# Altium project ESE516_IoTracking.PrjPcb
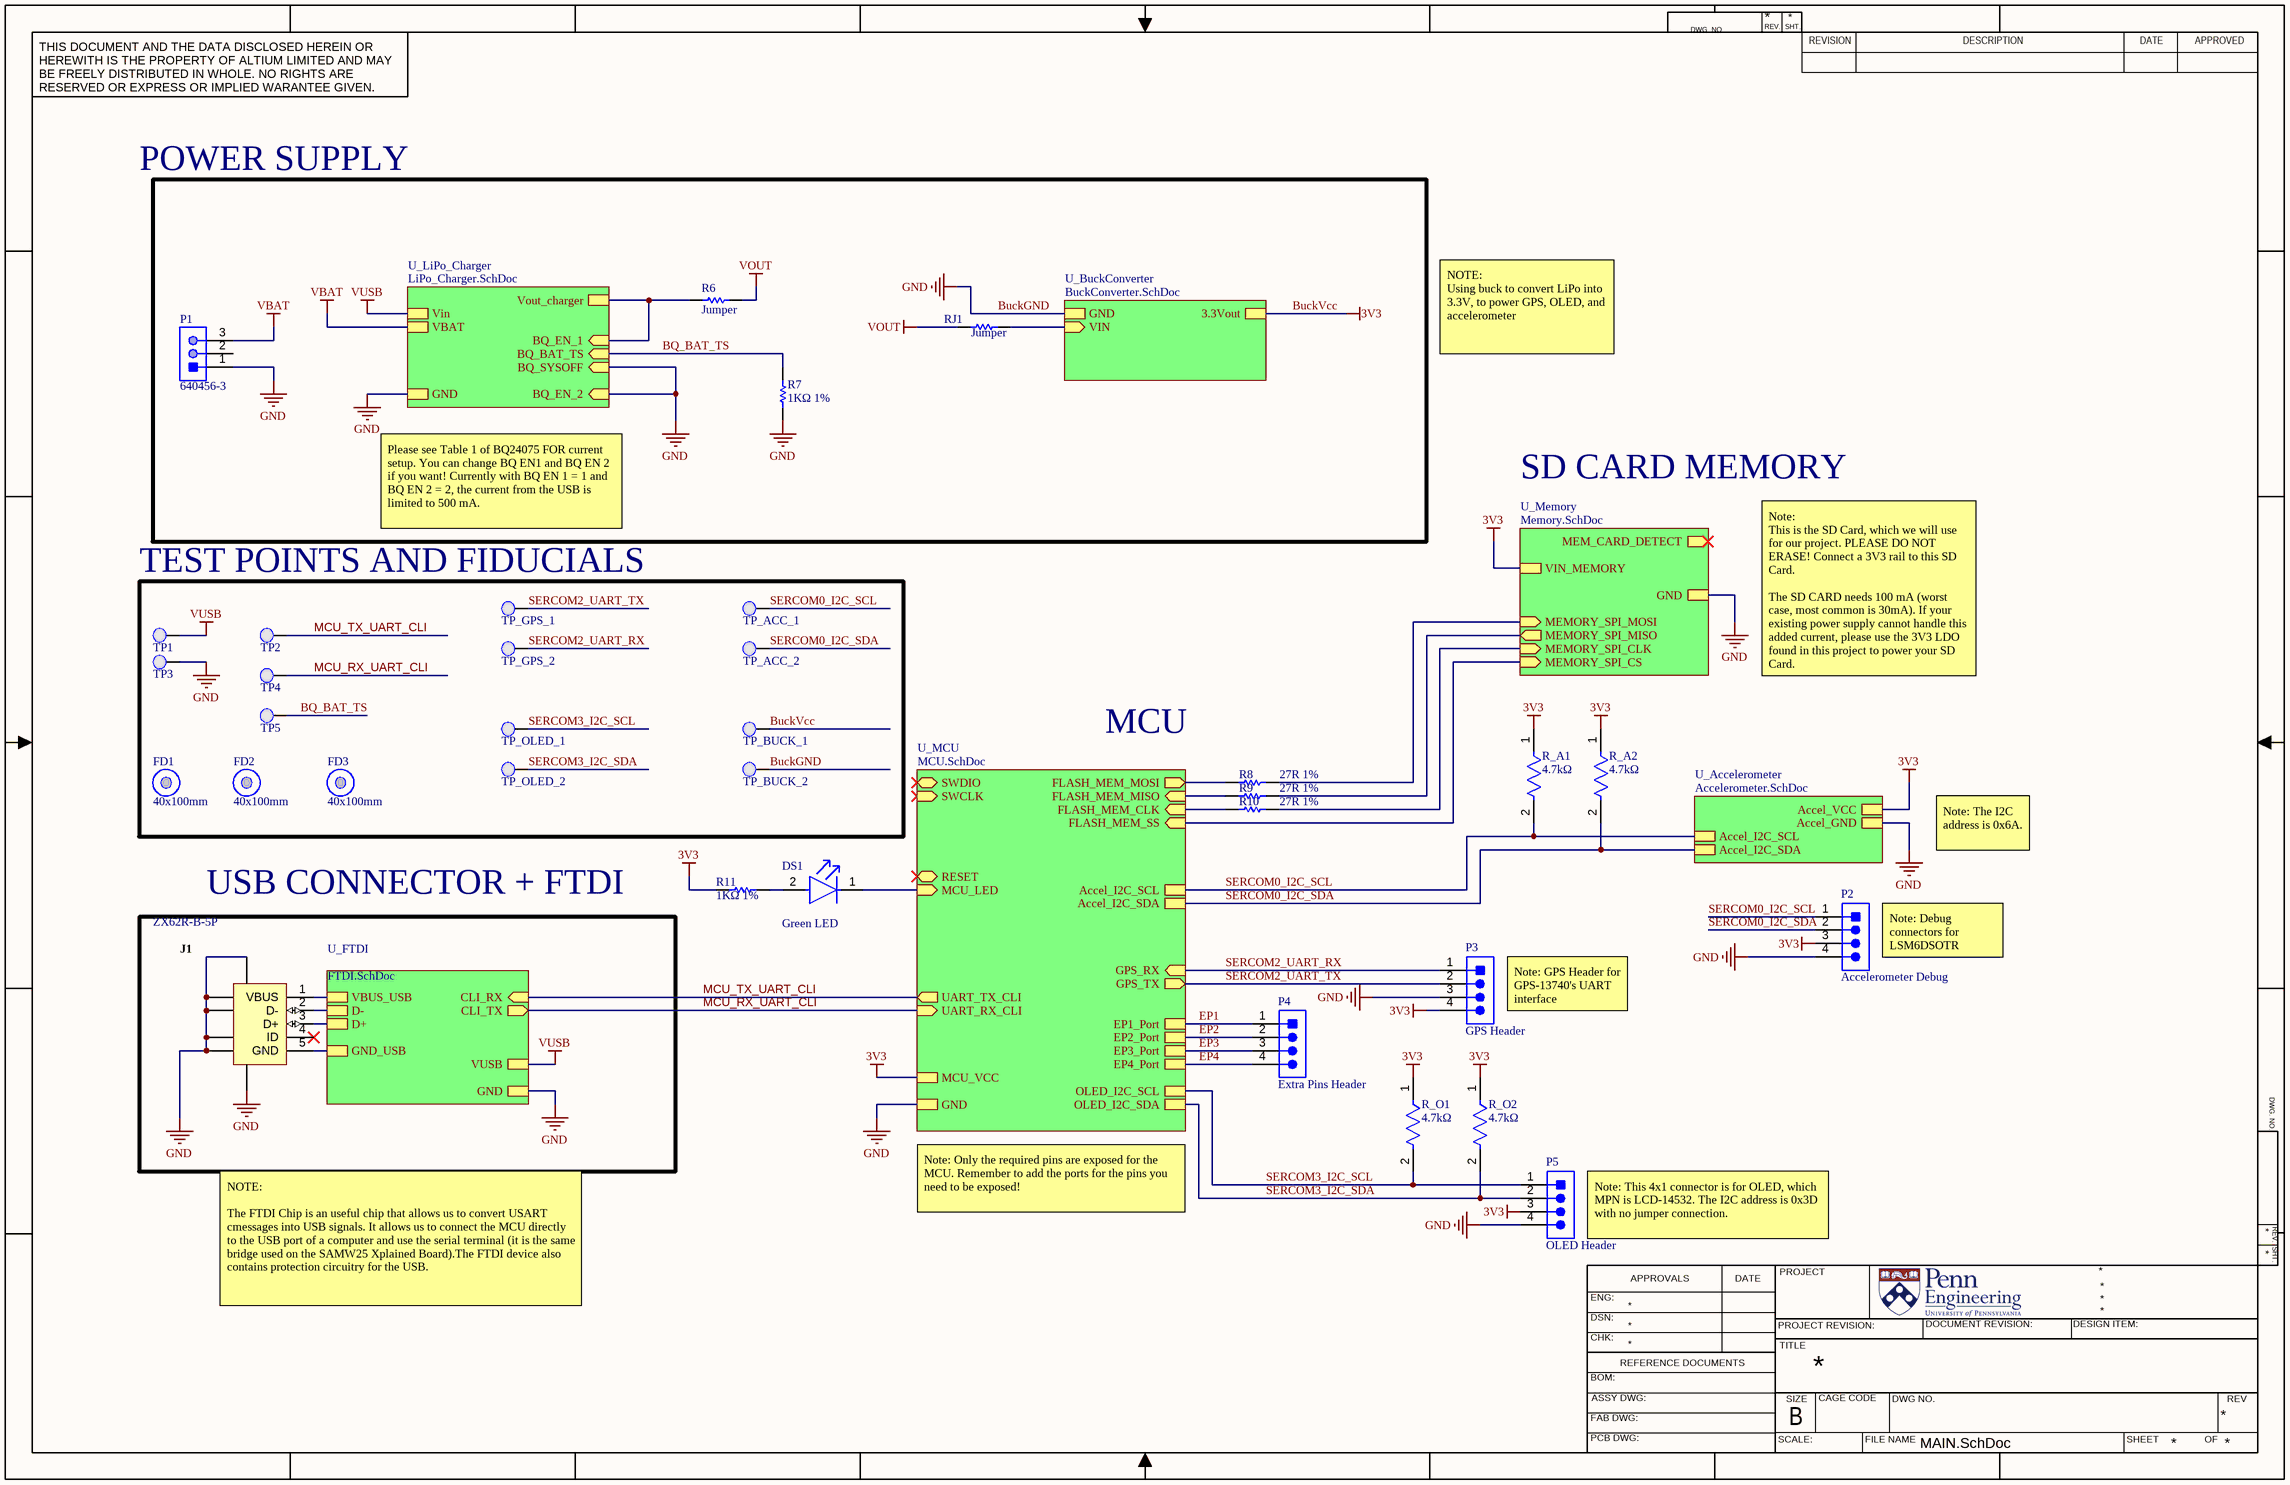
[diagram p0: MAIN.SchDoc]
7 sheets, 94 parts. Net scope: strictly hierarchical (ports join the sheet entries above them; power ports are local).
Board file: IoTracking_PCB.PcbDoc
Sheets:
  MAIN.SchDoc
    U_FTDI = FTDI.SchDoc
    U_Memory = Memory.SchDoc
    U_LiPo_Charger = LiPo_Charger.SchDoc
    U_BuckConverter = BuckConverter.SchDoc
    U_Accelerometer = Accelerometer.SchDoc
    U_MCU = MCU.SchDoc

## Sheet MAIN.SchDoc
size 431 x 279 mm

### Parts
DS1  Green LED  [FP-LTST-C191KGKT-MFG]
FD1  40x100mm  [Fiducial_FT]
FD2  40x100mm  [Fiducial_FT]
FD3  40x100mm  [Fiducial_FT]
J1  ZX62R-B-5P  [HIRO-ZX62R-B-5P_V]
P1  640456-3  [TECO-640456-3]
P2  Accelerometer Debug  [TECO-640456-4]
P3  GPS Header  [TECO-640456-4]
P4  Extra Pins Header  [TECO-640456-4]
P5  OLED Header  [TECO-640456-4]
R6  Jumper  [RESC0805(2012)_N]
R7  1KΩ 1%  [RESC1609X50X30LL10T20]
R8  27R 1%  [RESC0603(1608)_N]
R9  27R 1%  [RESC0603(1608)_N]
R10  27R 1%  [RESC0603(1608)_N]
R11  1KΩ 1%  [RESC1609X50X30LL10T20]
R_A1  4.7kΩ  [FP-AT0603-MFG]
R_A2  4.7kΩ  [FP-AT0603-MFG]
R_O1  4.7kΩ  [FP-AT0603-MFG]
R_O2  4.7kΩ  [FP-AT0603-MFG]
RJ1  Jumper  [RESC1609X50X30LL10T20]
TP1  0.1" Pad  [PCBComponent]  (value not drawn)
TP2  0.1" Pad  [PCBComponent]  (value not drawn)
TP3  0.1" Pad  [PCBComponent]  (value not drawn)
TP4  0.1" Pad  [PCBComponent]  (value not drawn)
TP5  0.1" Pad  [PCBComponent]  (value not drawn)
TP_ACC_1  0.1" Pad  [PCBComponent]  (value not drawn)
TP_ACC_2  0.1" Pad  [PCBComponent]  (value not drawn)
TP_BUCK_1  0.1" Pad  [PCBComponent]  (value not drawn)
TP_BUCK_2  0.1" Pad  [PCBComponent]  (value not drawn)
TP_GPS_1  0.1" Pad  [PCBComponent]  (value not drawn)
TP_GPS_2  0.1" Pad  [PCBComponent]  (value not drawn)
TP_OLED_1  0.1" Pad  [PCBComponent]  (value not drawn)
TP_OLED_2  0.1" Pad  [PCBComponent]  (value not drawn)

### Blocks framed on the sheet
TEST POINTS AND FIDUCIALS: FD1-FD3 TP1-TP5 TP_ACC_1 TP_ACC_2 TP_BUCK_1 TP_BUCK_2 TP_GPS_1 TP_GPS_2 TP_OLED_1 TP_OLED_2
USB CONNECTOR + FTDI: J1

### Sub-sheets
U_Accelerometer = Accelerometer.SchDoc: Accel_VCC, Accel_GND, Accel_I2C_SCL, Accel_I2C_SDA
U_BuckConverter = BuckConverter.SchDoc: VIN (in), GND, 3.3Vout
U_FTDI = FTDI.SchDoc: CLI_RX (in), CLI_TX (out), VUSB, GND, VBUS_USB, D-, D+, GND_USB
U_LiPo_Charger = LiPo_Charger.SchDoc: BQ_EN_2 (in), BQ_SYSOFF (in), BQ_EN_1 (in), BQ_BAT_TS (in), Vin, GND, VBAT, Vout_charger
U_MCU = MCU.SchDoc: SWDIO (bidir), SWCLK (in), UART_TX_CLI (out), UART_RX_CLI (in), FLASH_MEM_SS (in), FLASH_MEM_CLK (in), FLASH_MEM_MISO (in), FLASH_MEM_MOSI (out), RESET (bidir), MCU_LED (in), MCU_VCC, GND, GPS_RX (in), GPS_TX (out), OLED_I2C_SCL, OLED_I2C_SDA, Accel_I2C_SCL, Accel_I2C_SDA, EP2_Port, EP3_Port, EP4_Port, EP1_Port
U_Memory = Memory.SchDoc: MEMORY_SPI_MOSI (in), MEMORY_SPI_MISO (out), MEMORY_SPI_CLK (in), MEMORY_SPI_CS (in), MEM_CARD_DETECT (out), VIN_MEMORY, GND

### Nets
3V3: P2.3 P3.4 P5.3 R11.1 R_A1.1 R_A2.1 R_O1.1 R_O2.1 TP_BUCK_1.1(PAD) ; sheet U_Memory/VIN_MEMORY, sheet U_BuckConverter/3.3Vout, sheet U_Accelerometer/Accel_VCC, sheet U_MCU/MCU_VCC  [also labelled BuckVcc]
Buck_Vin: RJ1.2 ; sheet U_BuckConverter/VIN
GND: J1.5(GND) J1.6(SHLD) J1.7(SHLD) J1.8(SHLD) J1.9(SHLD) J1.10(SHLD) J1.11(SHLD) P1.1 P2.4 P3.3 P5.4 R7.2 TP3.1(PAD) TP_BUCK_2.1(PAD) ; sheet U_FTDI/GND, sheet U_FTDI/GND_USB, sheet U_Memory/GND, sheet U_LiPo_Charger/BQ_EN_2, sheet U_LiPo_Charger/BQ_SYSOFF, sheet U_LiPo_Charger/GND, sheet U_BuckConverter/GND, sheet U_Accelerometer/Accel_GND, sheet U_MCU/GND  [also labelled BuckGND]
VBAT: P1.3 ; sheet U_LiPo_Charger/VBAT
VBUS: J1.1(VBUS) ; sheet U_FTDI/VBUS_USB
VOUT: R6.2 RJ1.1
Vout_BQ: R6.1 ; sheet U_LiPo_Charger/BQ_EN_1, sheet U_LiPo_Charger/Vout_charger
VUSB: TP1.1(PAD) ; sheet U_FTDI/VUSB, sheet U_LiPo_Charger/Vin
BQ_BAT_TS: R7.1 TP5.1(PAD) ; sheet U_LiPo_Charger/BQ_BAT_TS
EP1: P4.1 ; sheet U_MCU/EP1_Port
EP2: P4.2 ; sheet U_MCU/EP2_Port
EP3: P4.3 ; sheet U_MCU/EP3_Port
EP4: P4.4 ; sheet U_MCU/EP4_Port
FLASH_MEM_SPI_SS: sheet U_Memory/MEMORY_SPI_CS, sheet U_MCU/FLASH_MEM_SS
MCU_LED: DS1.1(C) ; sheet U_MCU/MCU_LED
MCU_RX_UART_CLI: TP4.1(PAD) ; sheet U_FTDI/CLI_TX, sheet U_MCU/UART_RX_CLI
MCU_TX_UART_CLI: TP2.1(PAD) ; sheet U_FTDI/CLI_RX, sheet U_MCU/UART_TX_CLI
MEM_SPI_CLK: R10.2 ; sheet U_Memory/MEMORY_SPI_CLK
MEM_SPI_MISO: R9.2 ; sheet U_Memory/MEMORY_SPI_MISO
MEM_SPI_MOSI: R8.2 ; sheet U_Memory/MEMORY_SPI_MOSI
SERCOM0_I2C_SCL: P2.1 R_A1.2 TP_ACC_1.1(PAD) ; sheet U_Accelerometer/Accel_I2C_SCL, sheet U_MCU/Accel_I2C_SCL
SERCOM0_I2C_SDA: P2.2 R_A2.2 TP_ACC_2.1(PAD) ; sheet U_Accelerometer/Accel_I2C_SDA, sheet U_MCU/Accel_I2C_SDA
SERCOM1_PAD2_SPI_MISO: R9.1 ; sheet U_MCU/FLASH_MEM_MISO
SERCOM1_PAD2_SPI_MOSI: R8.1 ; sheet U_MCU/FLASH_MEM_MOSI
SERCOM1_PAD3_SPI_SCK: R10.1 ; sheet U_MCU/FLASH_MEM_CLK
SERCOM2_UART_RX: P3.1 TP_GPS_2.1(PAD) ; sheet U_MCU/GPS_RX
SERCOM2_UART_TX: P3.2 TP_GPS_1.1(PAD) ; sheet U_MCU/GPS_TX
SERCOM3_I2C_SCL: P5.1 R_O1.2 TP_OLED_1.1(PAD) ; sheet U_MCU/OLED_I2C_SCL
SERCOM3_I2C_SDA: P5.2 R_O2.2 TP_OLED_2.1(PAD) ; sheet U_MCU/OLED_I2C_SDA
USB_DATA_N: J1.2(D-) ; sheet U_FTDI/D-
USB_DATA_P: J1.3(D+) ; sheet U_FTDI/D+
NetDS1_2: DS1.2(A) R11.2

Not connected (* = marked no-connect by the designer): J1 4(ID)*; P1 2

### Notes on the sheet
- POWER SUPPLY
- NOTE:
  Using buck to convert LiPo into 3.3V, to power GPS, OLED, and accelerometer
- SD CARD MEMORY
- Please see Table 1 of BQ24075 FOR current setup. You can change BQ EN1 and BQ EN 2 if you want! Currently with BQ EN 1 = 1 and BQ EN 2 = 2, the current from the USB is limited to 500 mA.
- Note:
  This is the SD Card, which we will use for our project. PLEASE DO NOT ERASE! Connect a 3V3 rail to this SD Card.
  The SD CARD needs 100 mA (worst case, most common is 30mA). If your existing power supply cannot handle this added current, please use the 3V3 LDO found in this project to power your SD Card.
- MCU
- Note: The I2C address is 0x6A.
- (near P2) Note: Debug connectors for LSM6DSOTR accelerometer's I2C.
- (near P3) Note: GPS Header for GPS-13740's UART interface
- Note: Only the required pins are exposed for the MCU. Remember to add the ports for the pins you need to be exposed!
- (near P5) Note: This 4x1 connector is for OLED, which MPN is LCD-14532. The I2C address is 0x3D with no jumper connection.
- NOTE:
  The FTDI Chip is an useful chip that allows us to convert USART cmessages into USB signals. It allows us to connect the MCU directly to the USB port of a computer and use the serial terminal (it is the same bridge used on the SAMW25 Xplained Board).The FTDI device also contains protection circuitry for the USB.
- DWG. NO.
- REV.
- SHT.
- THIS DOCUMENT AND THE DATA DISCLOSED HEREIN OR HEREWITH IS THE PROPERTY OF ALTIUM LIMITED AND MAY BE FREELY DISTRIBUTED IN WHOLE. NO RIGHTS ARE RESERVED OR EXPRESS OR IMPLIED WARANTEE GIVEN.
- REVISION
- DESCRIPTION
- DATE
- APPROVED
- ENG:
- APPROVALS
- PROJECT
- DSN:
- CHK:
- REFERENCE DOCUMENTS
- PROJECT REVISION:
- TITLE
- DOCUMENT REVISION:
- DESIGN ITEM:
- BOM:
- FAB DWG:
- PCB DWG:
- ASSY DWG:
- SCALE:
- SIZE
- B
- CAGE CODE
- FILE NAME
- DWG NO.
- SHEET
- OF
- REV

### Library data of the parts
DS1 = CMP-2000-05198-2: LED GREEN CLEAR SMD; Forward Voltage: 2V; Number of Elements: 1; Viewing Angle: 130°; Forward Current: 30mA; Luminous Intensity: 35mcd; Reverse Voltage: 5V; Power Dissipation: 75mW; Dominant Wavelength: 571nm; Lens Color: Colorless; Lens Style: Rectangular; Test Current: 20mA; Wavelength: 574nm; Packaging: Tape and Reel; Case/Package: 0603; Case Code (Imperial): 0603; Case Code (Metric): 1608; Color: Green; Depth: 0.8mm; Height: 0.55mm; Illumination Color: Green; Lead Free: Lead Free; Length: 1.6mm; Lens Transparency: Clear; Max Operating Temperature: 85°C; Max Power Dissipation: 75mW; Min Operating Temperature: -55°C; Mount: Surface Mount; Number of LEDs: 1; Number of Pins: 2; Package Quantity: 1; Power Rating: 75mW; Radiation Hardening: No; Width: 0.8mm
FD1-FD3 = CMP-00174-A.4: Fiducial 40x100mm
J1 = CMP-0031-00001-1: Connector; USBMicro-B,Reverse type, SMT; 5 Position; Right Angle; DatasheetVersion: 08/2010; Operating Temperature: -30 to 85 degC; Mounting Technology: Surface Mount; PartNumber: ZX62R-B-5P; PackageReference: ZX62R-B-5P; ComponentLink2URL: http://www.hirose.co.jp/cataloge_hp/e24200011.pdf; ComponentLink1URL: http://www.hirose.com/â€Ž; ComponentLink2Description: Datasheet; PackageDescription: 5-Pin USB Micro-B R/A Connector; ComponentLink1Description: Manufacturer URL
P1 = CMP-2000-05418-1: Male Header, Pitch 2.54 mm, 1 x 3 Position, Height 10.03 mm, Tail Length 3.56 mm, -55 to 105 degC; Manufacturer: TE Connectivity; Agency Approvals: CSA,UL; Angle: Straight; Number of Positions: 3; Standards: RoHSCompliant,ELVCompliant,UL94V-0; Current, Rating: 5 / A; Connector Type: MTA-100; Mount Angle: Vertical; Material, Housing: Polyester; Temperature, Operating: -55to+105 / degC; Voltage, Rating: 250 / V; Color, Housing: White; Contact Centerline Spacing: 0.100 / in.; Special Features: Pinstrip; Material, Contact: CopperAlloy; Contact Termination Area Plating: Tin; Primary Type: InterconnectSystem; Pin Spacing: 0.1 / "; Brand/Series: MTA-100Series; Mounting Hole Size: 0.04 / "; Manufacturer URL: http://www.te.com/; Datasheet URL: https://datasheet.ciiva.com/16456/eng-ds-82056-mta-0608-16456886.pdf; Flammability Rating: UL94V-0; Mounting Type: PCMount; Contact Mating Area Plating: Tin; Datasheet Version: Jun-08; Number of Rows: 1; Termination: Solder; Type: PCBPlug; Length, Pin: 0.14 / "; Color: White; Contact Plating: Tin; Contact Shape: Square; Number of Contacts: 3; Size, Post: 0.025 / in.; Length, Terminal Post: 0.14 / in.; Length, Overall: 0.3 / "
P2-P5 = CMP-2000-05419-1: Male Header, Pitch 2.54 mm, 1 x 4 Position, Height 10.03 mm, Tail Length 3.56 mm, RoHS, Bulk; Manufacturer: TE Connectivity; Material, Housing: Polyester; Primary Type: InterconnectSystem; Mount Angle: Vertical; Color, Housing: White; Current, Rating: 5 / A; Agency Approvals: CSA,UL; Contact Termination Area Plating: Tin; Temperature, Operating: -55to+105 / degC; Standards: RoHSCompliant,ELVCompliant,UL94V-0; Number of Positions: 4; Brand/Series: MTA-100Series; Angle: Straight; Pin Spacing: 0.1 / "; Material, Contact: CopperAlloy; Connector Type: MTA-100; Special Features: Pinstrip; Mounting Hole Size: 0.04 / "; Contact Centerline Spacing: 0.100 / in.; Voltage, Rating: 250 / V; Manufacturer URL: http://www.te.com/; Length, Pin: 0.14 / "; Length, Overall: 0.4 / "; Color: White; Flammability Rating: UL94V-0; Mounting Type: PCMount; Termination: Solder; Datasheet URL: https://datasheet.ciiva.com/16286/eng-ds-82056-mta-0608-16286228.pdf; Number of Contacts: 4; Contact Shape: Square; Contact Mating Area Plating: Tin; Length, Terminal Post: 0.14 / in.; Size, Post: 0.025 / in.; Contact Plating: Tin; Type: PCBPlug; Datasheet Version: Dec-14; Number of Rows: 1
R6 = CMP-1013-00001-1: Jumper 0805 (2012 Metric); Case-EIA: 0805; Value: 0.00 Ohm; Tolerance: None; Case-Metric: 2012; Technology: SMT; Power: None
R7 R11 = CMP-1012-00510-2: 1KΩ 1%CRCW06031K00FKEB; Manufacturer: Vishay Dale; Part Number: CRCW06031K00FKEB
R8-R10 = CMP-1012-00331-1: 27R 0.1W 1% 0603 (1608 Metric)  SMD; Case-EIA: 0603; Value: 27.00 Ohm; Case-Metric: 1608; Technology: SMT; Tolerance: 1 %; Power: 0.1 W
R_A1 R_A2 R_O1 R_O2 = CMP-03412-008985-1: RES SMD 4.7K OHM 0.5% 1/10W 0603; Manufacturer: Yageo; Manufacturer Part Number: AT0603DRD074K7L; Power Rating: 0.1W; Voltage Rating: 75V; Tolerance: 0.005; Temperature Coefficient: 25 ppm/°C; Automotive Grade: Grade 0; ComponentLink2URL: http://www.yageo.com/documents/recent/PYu-AT_51_RoHS_L_5.pdf; Digikey Description: RES SMD 4.7K OHM 0.5% 1/10W 0603; Automotive: Yes; Temperature: -55°C to +155°C; Ipc Land Pattern Name: RESC16080X45; RoHS: TRUE; Temperature Range Low: -55°C; Value: 4.7KΩ; Temperature Range High: +155°C; Device Class L3: Chip SMD Resistors; Series: AT; Device Class L1: Passive Components; Package: AT0603; Resistance: 4.7KΩ; ComponentLink2Description: Datasheet; Mouser Description: Res Thin Film 0603 4.7K Ohm 0.5% 0.1W(1/10W) ±25ppm/C Sulfur Resistant Epoxy Pad SMD Automotive T/R; Lead Free: Yes; Category: Res; Footprint Url: http://www.yageo.com/exep/pages/download/literatures/PYu-R_Mount_9.pdf; Device Class L2: Resistors; Height: 0.55mm; Octopart: https://octopart.com/at0603drd074k7l-yageo-71378151
RJ1 = CMP-1012-00001-2: 0 Ohm CRCW06030000Z0EC; Manufacturer: Vishay Dale; Part Number: CRCW06030000Z0EC
TP1-TP5 TP_ACC_1 TP_ACC_2 TP_BUCK_1 TP_BUCK_2 TP_GPS_1 TP_GPS_2 TP_OLED_1 TP_OLED_2 = 0.1" Pad-A.4

## Sheet FTDI.SchDoc: USB Slot + FTDI
size 431 x 279 mm; Revision: 1.0; SheetNumber: 1; SheetTotal: 1
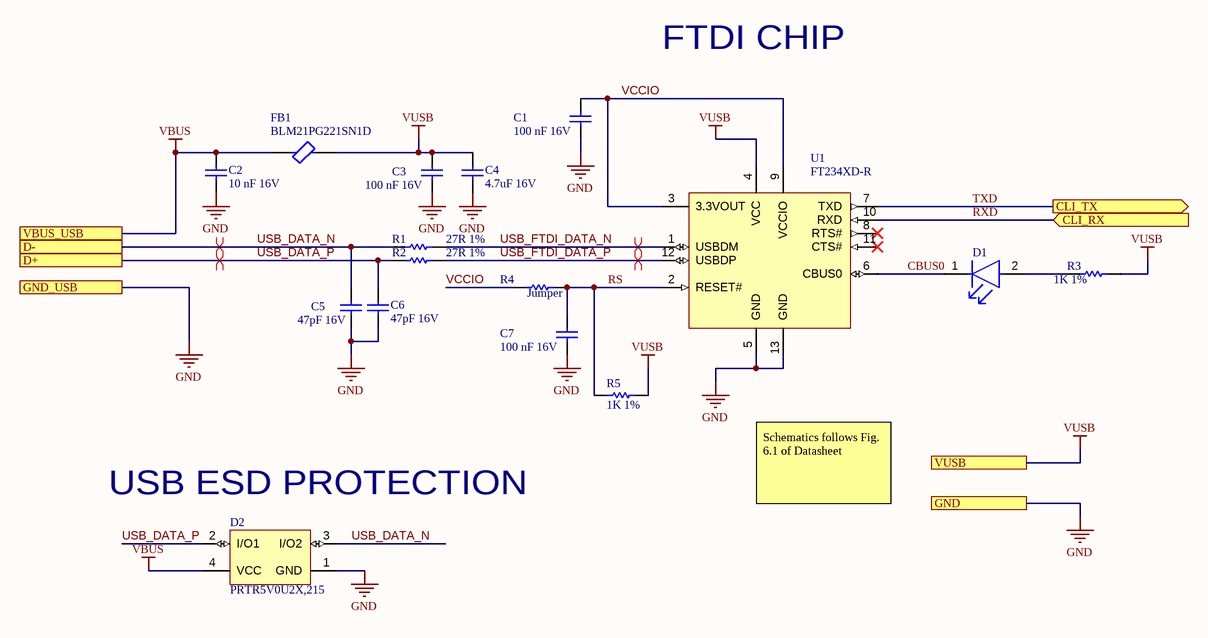
[diagram p1: FTDI.SchDoc]

### Parts
C1  100 nF 16V  [CAPC1608X95X40LL15T15]
C2  10 nF 16V  [CAPC1608X87X35NL15T15]
C3  100 nF 16V  [CAPC1608X95X40LL15T15]
C4  4.7uF 16V  [CAPC0805(2012)145_N]
C5  47pF 16V  [CAPC0603(1608)100_N]
C6  47pF 16V  [CAPC0603(1608)100_N]
C7  100 nF 16V  [CAPC1608X95X40LL15T15]
D1  LTST-C170CKT  [FP-LTST-C170CKT-MFG]  (value not drawn)
D2  PRTR5V0U2X,215  [NXP-SOT143B-4_V]
FB1  BLM21PG221SN1D  [FP-BLM21-0_2-t0_85-e0_5-IPC_A]
R1  27R 1%  [RESC0603(1608)_N]
R2  27R 1%  [RESC0603(1608)_N]
R3  1K 1%  [RESC1609X50X30LL10T20]
R4  Jumper  [RESC1609X50X30LL10T20]
R5  1K 1%  [RESC1609X50X30LL10T20]
U1  FT234XD-R  [DFN-12_V]

### Ports
CLI_RX (in), CLI_TX (out), D+, D-, GND, GND_USB, VBUS_USB, VUSB

### Nets
GND: C1.1 C2.1 C3.1 C4.1 C5.1 C6.1 C7.1 D2.1(GND) U1.5(GND) U1.13(GND) ; port GND, port GND_USB
VBUS: C2.2 D2.4(VCC) FB1.1 ; port VBUS_USB
VUSB: C3.2 C4.2 FB1.2 R3.2 R5.1 U1.4(VCC) ; port VUSB
CBUS0: D1.1(C) U1.6(CBUS0)  [project net CBUS0_1]
RS: C7.2 R4.2 R5.2 U1.2(RESET#)  [project net RS_1]
RXD: U1.10(RXD) ; port CLI_RX  [project net MCU_TX_UART_CLI]
TXD: U1.7(TXD) ; port CLI_TX  [project net MCU_RX_UART_CLI]
USB_DATA_N: C5.2 D2.3(I/O2) R1.1 ; port D-
USB_DATA_P: C6.2 D2.2(I/O1) R2.1 ; port D+
USB_FTDI_DATA_N: R1.2 U1.1(USBDM)  [project net USB_FTDI_DATA_N_1]
USB_FTDI_DATA_P: R2.2 U1.12(USBDP)  [project net USB_FTDI_DATA_P_1]
VCCIO: C1.2 R4.1 U1.3(3.3VOUT) U1.9(VCCIO)  [project net VCCIO_1]
NetD1_2: D1.2(A) R3.1

Not connected (* = marked no-connect by the designer): U1 8(RTS#)* 11(CTS#)*

### Layout directives
differential pair: USB_DATA_N, USB_DATA_P, USB_FTDI_DATA_N_1, USB_FTDI_DATA_P_1

### Notes on the sheet
- FTDI CHIP
- (near D2) USB ESD PROTECTION
- Schematics follows Fig. 6.1 of Datasheet
- DWG. NO.
- REV.
- SHT.
- THIS DOCUMENT AND THE DATA DISCLOSED HEREIN OR HEREWITH IS THE PROPERTY OF ALTIUM LIMITED AND MAY BE FREELY DISTRIBUTED IN WHOLE. NO RIGHTS ARE RESERVED OR EXPRESS OR IMPLIED WARANTEE GIVEN.
- REVISION
- DESCRIPTION
- DATE
- APPROVED
- ENG:
- APPROVALS
- PROJECT
- DSN:
- CHK:
- REFERENCE DOCUMENTS
- PROJECT REVISION:
- TITLE
- DOCUMENT REVISION:
- DESIGN ITEM:
- BOM:
- FAB DWG:
- PCB DWG:
- ASSY DWG:
- SCALE:
- SIZE
- B
- CAGE CODE
- FILE NAME
- DWG NO.
- SHEET
- OF
- REV

### Library data of the parts
C1 C3 C7 = CMP-1035-02584-2: VJ0603Y104KXJCW1BC; Manufacturer: Vitramon; Part Number: VJ0603Y104KXJCW1BC
C2 = CMP-1035-02311-2: C0603C103K4RACTU; Manufacturer: Kemet; Part Number: C0603C103K4RACTU
C4 = CMP-1036-04893-1: CAP 4.7uF 16V -20% to +80% 0805 (2012 Metric) Thickness 1.45mm SMD; Case-Metric: 2012; Case-EIA: 0805; Max Thickness: 1.45 mm; Value: 4.7uF; Rated Voltage: 16 V; Tolerance: -20% to +80%; Technology: SMT
C5 C6 = CMP-1035-01048-1: CAP 47pF 16V ±0.5pF 0603 (1608 Metric) Thickness 1mm SMD; Case-EIA: 0603; Case-Metric: 1608; Tolerance: Â±0.5pF; Technology: SMT; Value: 47pF; Rated Voltage: 16 V; Max Thickness: 1 mm
D1 = CMP-1674-00001-6: LED RED CLEAR SMD; Dominant Wavelength: 638nm; Forward Current: 40mA; Forward Voltage: 1.8V; Lens Color: Colorless; Lens Style: Diffused; Luminous Intensity: 10mcd; Max Power Dissipation: 100mW; Number of Elements: 1; Reverse Voltage: 5V; Test Current: 10mA; Viewing Angle: 130°; Wavelength: 660nm; Package Quantity: 1; Packaging: Tape and Reel; Max Operating Temperature: 85°C; Min Operating Temperature: -55°C; Mount: Surface Mount; Length: 2mm; Height: 1.1mm; Case/Package: 0805; Case Code (Imperial): 0805; Case Code (Metric): 2012; Color: Red; Depth: 1.25mm; Illumination Color: Red; Lead Free: Lead Free; Lens Transparency: Clear; Number of LEDs: 1; Number of Pins: 2; Power Dissipation: 100mW; Power Rating: 100mW; Radiation Hardening: No; Voltage: 5V; Width: 1.25mm
D2 = CMP-2000-05285-1: Ultra Low Capacitance Double Rail-to-Rail ESD Protection Diode, 5.5 V, 1 pF, -40 to 85 degC, 4-Pin SOT143B, RoHS, Tape and Reel; Manufacturer: NXP Semiconductors; Capacitance Value: 16pF; Number of Elements: 1; Rad Hardened: No; Reverse Breakdown Voltage: 6V; Working Voltage (Max): 5.5V; Polarity: Uni-Directional; Configuration: Quad; Leakage Current: 0.1uA; Product Height (mm): 1mm; Suppressor Type: DiodeArrays; Product Length (mm): 3mm; Product Depth (mm): 1.4mm; ESD Protection Voltage: 8KV@ContactDisc; Package Type: SOT; Mounting: SurfaceMount; Packaging: TapeandReel; Datasheet Version: Rev. 02, 01/2008; Reverse Stand-off Voltage: 5.5V; Manufacturer URL: http://www.nxp.com/; Operating Temp Range: -40Cto85C; Operating Temperature Classification: Industrial; Working Voltage: 5.5V; Operating Temperature Min Deg. C: -40C; Datasheet URL: https://datasheet.ciiva.com/4479/prtr5v0u2x-102853-4479461.pdf; Leakage Current (Max): 0.1uA; Direction Type: Uni-Directional; Pin Count: 3+Tab; Operating Temperature Max Deg. C: 85C; Mounting Style: SurfaceMount; Package / Case: SOT
FB1 = CMP-0686-00610-3: Chip Ferrite Bead, 0805, 220Ω @ 100MHz, 0.045Ω, 25%, 2A; DC Resistance (DCR): 45mR; Impedance: 220R; Number of Circuits: 1; Shielding: Unshielded; Case/Package: 0805; Case Code (Imperial): 0805; Case Code (Metric): 2012; Contact Plating: Tin; Core Material: Ferrite; Current: 2A; Current Rating: 2A; DC Current: 2A; DC Resistance-Max: 45mR; Depth: 1.25mm; Frequency: 100MHz; Height: 0.85mm; Lead Free: Lead Free; Length: 2mm; Material: Ferrite; Max Current Rating: 2A; Max DC Current: 2A; Max Operating Temperature: 125°C; Military Standard: Not; Min Operating Temperature: -55°C; Number of Lines: 1; Number of Pins: 2; Package Quantity: 1; Packaging: Tape and Reel; Radiation Hardening: No; REACH SVHC: No SVHC; RoHS Compliant: Yes; Series: BLM21P; Termination: SMD/SMT; Test Frequency: 100MHz; Tolerance: 25%; Width: 1.25mm
R1 R2 = CMP-1012-00331-1: as R8 on sheet MAIN; Technology: SMT; Tolerance: 1 %; Power: 0.1 W
R3 R5 = CMP-1012-00510-2: CRCW06031K00FKEB; Manufacturer: Vishay Dale; Part Number: CRCW06031K00FKEB
R4 = CMP-1012-00001-2: Manufacturer: Vishay Dale; Part Number: CRCW06030000Z0EC
U1 = CMP-0248-00027-1: FT234XD USB to BASIC UART IC, -40 to +85 degC, 12-Pin DFN, Pb-Free, Tape and Reel; Manufacturer: FTDI; PackageReference: DFN-12; PackageVersion: Feb-13; DatasheetVersion: ver 1.1, Feb-2013; ComponentLink1URL: http://www.ftdichip.com/; PartNumber: FT234XD-R; ComponentLink2URL: http://www.ftdichip.com/Support/Documents/DataSheets/ICs/DS_FT234XD.pdf; ComponentLink1Description: Manufacturer URL; PackageDescription: 12-Pin Dual Flat No-Lead, 3 x 3 mm Body, 0.45 mm Pitch, Exposed Pad; ComponentLink2Description: Datasheet

## Sheet Memory.SchDoc: SD Card Module
size 431 x 279 mm; Date: 2/26/2022; Engineer: Weihao Huang; Revision: 1.0; SheetNumber: 1; SheetTotal: 1
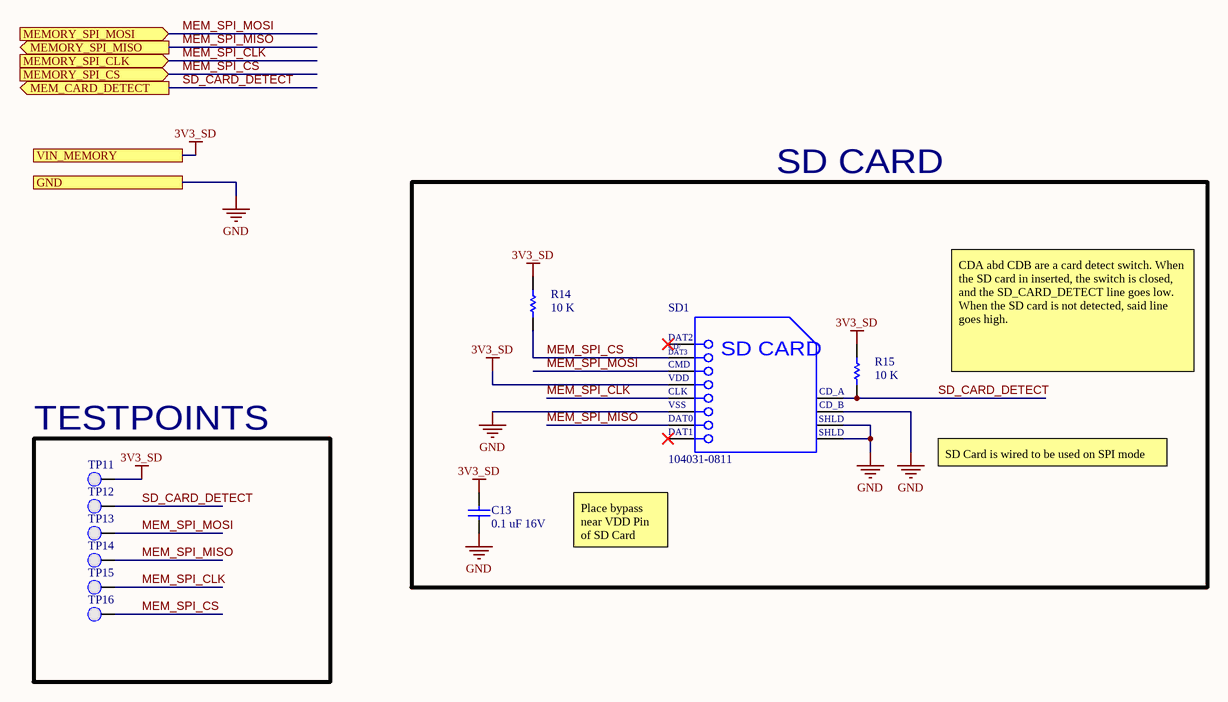
[diagram p2: Memory.SchDoc]

### Parts
C13  0.1 uF 16V  [CAPC1608X95X40LL15T15]
R14  10 K  [RESC1609X55X30LL15T15]
R15  10 K  [RESC1609X55X30LL15T15]
SD1  104031-0811  [MOLX-104031-0811_V]
TP11  0.1" Pad  [PCBComponent]  (value not drawn)
TP12  0.1" Pad  [PCBComponent]  (value not drawn)
TP13  0.1" Pad  [PCBComponent]  (value not drawn)
TP14  0.1" Pad  [PCBComponent]  (value not drawn)
TP15  0.1" Pad  [PCBComponent]  (value not drawn)
TP16  0.1" Pad  [PCBComponent]  (value not drawn)

### Blocks framed on the sheet
SD CARD: C13 R14 R15 SD1
TESTPOINTS: TP11-TP16

### Ports
GND, MEM_CARD_DETECT (out), MEMORY_SPI_CLK (in), MEMORY_SPI_CS (in), MEMORY_SPI_MISO (out), MEMORY_SPI_MOSI (in), VIN_MEMORY

### Nets
3V3_SD: C13.2 R14.2 R15.2 SD1.4(VDD) TP11.1(PAD) ; port VIN_MEMORY  [project net 3V3]
GND: C13.1 SD1.6(VSS2) SD1.10(CD_B) SD1.11(SHLD1) SD1.12(SHLD2) ; port GND
MEM_SPI_CLK: SD1.5(CLK) TP15.1(PAD) ; port MEMORY_SPI_CLK
MEM_SPI_CS: R14.1 SD1.2(CMD) TP16.1(PAD) ; port MEMORY_SPI_CS  [project net FLASH_MEM_SPI_SS]
MEM_SPI_MISO: SD1.7(DAT0) TP14.1(PAD) ; port MEMORY_SPI_MISO
MEM_SPI_MOSI: SD1.3(VSS1) TP13.1(PAD) ; port MEMORY_SPI_MOSI
SD_CARD_DETECT: R15.1 SD1.9(CD_A) TP12.1(PAD) ; port MEM_CARD_DETECT

Not connected (* = marked no-connect by the designer): SD1 1(CD/DAT3)* 8(DAT1)*

### Notes on the sheet
- CDA abd CDB are a card detect switch. When the SD card in inserted, the switch is closed, and the SD_CARD_DETECT line goes low. When the SD card is not detected, said line goes high.
- SD Card is wired to be used on SPI mode
- Place bypass near VDD Pin of SD Card
- DWG. NO.
- REV.
- SHT.
- THIS DOCUMENT AND THE DATA DISCLOSED HEREIN OR HEREWITH IS THE PROPERTY OF ALTIUM LIMITED AND MAY BE FREELY DISTRIBUTED IN WHOLE. NO RIGHTS ARE RESERVED OR EXPRESS OR IMPLIED WARANTEE GIVEN.
- REVISION
- DESCRIPTION
- DATE
- APPROVED
- ENG:
- APPROVALS
- PROJECT
- DSN:
- CHK:
- REFERENCE DOCUMENTS
- PROJECT REVISION:
- TITLE
- DOCUMENT REVISION:
- DESIGN ITEM:
- BOM:
- FAB DWG:
- PCB DWG:
- ASSY DWG:
- SCALE:
- SIZE
- B
- CAGE CODE
- FILE NAME
- DWG NO.
- SHEET
- OF
- REV
- (in symbol CMP-2000-05825-1) DAT2; CD/; DAT3; SD CARD; VSS; SHLD

### Library data of the parts
C13 = CMP-1035-02584-2: as C1 on sheet FTDI; Part Number: VJ0603Y104KXJCW1BC
R14 R15 = CMP-1012-00623-3: Chip Resistor, 10 KOhm, +/- 1%, 0.1 W, -55 to 155 degC, 0603 (1608 Metric), RoHS, Tape and Reel; Manufacturer: Panasonic; Case\/Package: 0603; Max Power Dissipation: 100mW; Resistance: 10KOhm; Temperature Coefficient: 100ppm\/degreesC; Voltage Rating (DC): 75V; Tolerance: 1%; Case Code (Imperial): 0603; Case Code (Metric): 1608; Composition: ThickFilm; Contact Plating: Tin; Datasheet URL: https://industrial.panasonic.com/cdbs/www-data/pdf/RDA0000/AOA0000C304.pdf; Datasheet Version: 02/2017; Depth: 0.8mm; Height: 0.45mm; Lead Free: LeadFree; Length: 1.6mm; Manufacturer URL: http://www.panasonic.com/; Max Operating Temperature: 155degC; Military Standard: Not; Min Operating Temperature: -55degC; Mount: SurfaceMount; Mounting Technology: SurfaceMount; Number of Pins: 2; Number of Terminations: 2; Package Description: 2-Pin Surface Mount Device, Body 1.6 x 0.85 mm; Package Quantity: 1; Package Reference: 603; Packaging: TapeandReel; Power Rating: 100mW; Radiation Hardening: No; REACH SVHC: NoSVHC; RoHSCompliant: true; Termination: SMD/SMT; Voltage Rating: 75V; Width: 0.031inch
SD1 = CMP-2000-05825-1: Micro SD Card, RA, -25 to 85 degC, 8-Pin SMD, RoHS, Tape and Reel; Voltage Rating: 10VAC/DC; Number of Contacts: 8; Insertion - Extraction Style: Push-Pull; Pitch: 1.1mm; Mating Cycles: 10000; Brand: Molex; Current Rating: 500mA; Manufacturer URL: http://www.molex.com/; Card Type: microSD; Mounting Type: Standard; Height: 1.42mm; Mounting Technology: SurfaceMount; Contact Plating: Gold; Product Category: MemoryCardConnectors; Package Description: 8-Pin Surface Mount Device, Body 11.95 x 11.4 mm, Pitch 1.1 mm; Datasheet URL: http://www.molex.com/pdm_docs/sd/1040310811_sd.pdf; Termination Style: SMD; Length: 11.4mm; Housing Material: LiquidCrystalPolymer(LCP); Orientation: RightAngle; RoHS: True; Contact Material: PhosphorBronze; Datasheet Version: Rev. E, 04/2006; Packaging: Reel; Manufacturer: Molex; Series: 104031; Product: CardConnectors; Number of Rows: 1Row; Package Reference: 104031-0811
TP11-TP16 = 0.1" Pad-A.4

## Sheet LiPo_Charger.SchDoc
size 431 x 279 mm
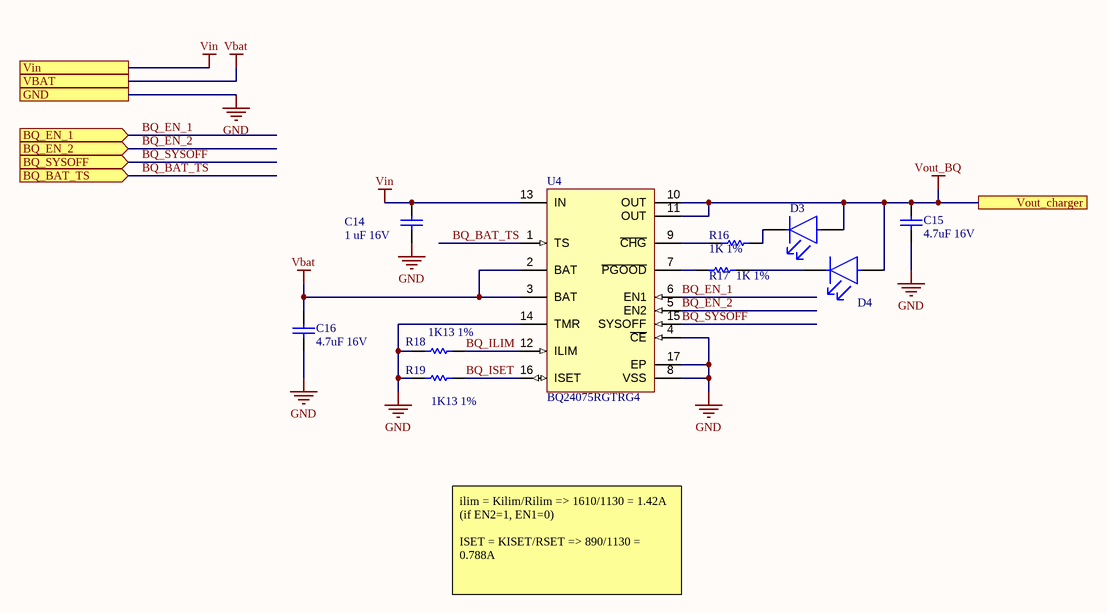
[diagram p3: LiPo_Charger.SchDoc]

### Parts
C14  1 uF 16V  [CAPC1608X90X35ML15T15]
C15  4.7uF 16V  [CAPC0805(2012)145_N]
C16  4.7uF 16V  [CAPC0805(2012)145_N]
D3  LTST-C170CKT  [FP-LTST-C170CKT-MFG]  (value not drawn)
D4  LTST-C170GKT  [FP-LTST-C170GKT-MFG]  (value not drawn)
R16  1K 1%  [RESC1609X50X30LL10T20]
R17  1K 1%  [RESC1609X50X30LL10T20]
R18  1K13 1%  [RESC0603(1608)_N]
R19  1K13 1%  [RESC0603(1608)_N]
U4  BQ24075RGTRG4  [RGT16-1700X1700TP]

### Ports
BQ_BAT_TS (in), BQ_EN_1 (in), BQ_EN_2 (in), BQ_SYSOFF (in), GND, VBAT, Vin, Vout_charger

### Nets
GND: C14.1 C15.1 C16.2 R18.1 R19.1 U4.4(~{CE}) U4.5(EN2) U4.8(VSS) U4.14(TMR) U4.15(SYSOFF) U4.17(EP) ; port BQ_EN_2, port BQ_SYSOFF, port GND  [also labelled BQ_EN_2, BQ_SYSOFF]
VBAT: C16.1 U4.2(BAT) U4.3(BAT) ; port VBAT
Vin: C14.2 U4.13(IN) ; port Vin  [project net VUSB]
Vout_BQ: C15.2 D3.2(A) D4.2(A) U4.6(EN1) U4.10(OUT) U4.11(OUT) ; port BQ_EN_1, port Vout_charger  [also labelled BQ_EN_1]
BQ_BAT_TS: U4.1(TS) ; port BQ_BAT_TS
BQ_ILIM: R18.2 U4.12(ILIM)
BQ_ISET: R19.2 U4.16(ISET)
NetD3_1: D3.1(C) R16.2
NetD4_1: D4.1(C) R17.2
NetR16_1: R16.1 U4.9(~{CHG})
NetR17_1: R17.1 U4.7(~{PGOOD})

### Notes on the sheet
- ilim = Kilim/Rilim => 1610/1130 = 1.42A (if EN2=1, EN1=0)
  ISET = KISET/RSET => 890/1130 = 0.788A
- DWG. NO.
- REV.
- SHT.
- THIS DOCUMENT AND THE DATA DISCLOSED HEREIN OR HEREWITH IS THE PROPERTY OF ALTIUM LIMITED AND MAY BE FREELY DISTRIBUTED IN WHOLE. NO RIGHTS ARE RESERVED OR EXPRESS OR IMPLIED WARANTEE GIVEN.
- REVISION
- DESCRIPTION
- DATE
- APPROVED
- ENG:
- APPROVALS
- PROJECT
- DSN:
- CHK:
- REFERENCE DOCUMENTS
- PROJECT REVISION:
- TITLE
- DOCUMENT REVISION:
- DESIGN ITEM:
- BOM:
- FAB DWG:
- PCB DWG:
- ASSY DWG:
- SCALE:
- SIZE
- B
- CAGE CODE
- FILE NAME
- DWG NO.
- SHEET
- OF
- REV

### Library data of the parts
C14 = CMP-1035-02736-2: 0603YC105JAT2A; Manufacturer: AVX Interconnect / Elco; Part Number: 0603YC105JAT2A
C15 C16 = CMP-1036-04893-1: as C4 on sheet FTDI; Max Thickness: 1.45 mm; Value: 4.7uF; Rated Voltage: 16 V; Tolerance: -20% to +80%; Technology: SMT
D3 = CMP-1674-00001-6: as D1 on sheet FTDI; Package Quantity: 1; Packaging: Tape and Reel; Max Operating Temperature: 85°C; Min Operating Temperature: -55°C; Mount: Surface Mount; Length: 2mm; Height: 1.1mm; Case/Package: 0805; Case Code (Imperial): 0805; Case Code (Metric): 2012; Color: Red; Depth: 1.25mm; Illumination Color: Red; Lead Free: Lead Free; Lens Transparency: Clear; Number of LEDs: 1; Number of Pins: 2; Power Dissipation: 100mW; Power Rating: 100mW; Radiation Hardening: No; Voltage: 5V; Width: 1.25mm
D4 = CMP-1674-00002-6: LED GREEN CLEAR SMD; Dominant Wavelength: 569nm; Forward Current: 30mA; Forward Voltage: 2.1V; Lens Color: Colorless; Lens Style: Diffused; Luminous Intensity: 6mcd; Number of Elements: 1; Power Dissipation: 100mW; Reverse Voltage: 5V; Test Current: 10mA; Viewing Angle: 130°; Wavelength: 565nm; Height: 1.1mm; Package Quantity: 1; Packaging: Tape and Reel; Mount: Surface Mount; Min Operating Temperature: -55°C; Max Operating Temperature: 85°C; Length: 2mm; Case/Package: 0805; Case Code (Imperial): 0805; Case Code (Metric): 2012; Color: Green; Depth: 1.25mm; Illumination Color: Green; Lead Free: Lead Free; Lens Transparency: Clear; Number of LEDs: 1; Number of Pins: 2; Power Rating: 100mW; Radiation Hardening: No; Voltage: 5V; Width: 1.25mm
R16 R17 = CMP-1012-00510-2: as R3 on sheet FTDI; Part Number: CRCW06031K00FKEB
R18 R19 = CMP-1012-00515-1: 1K13 0.1W 1% 0603 (1608 Metric)  SMD; Value: 1130.00 Ohm; Case-EIA: 0603; Case-Metric: 1608; Power: 0.1 W; Tolerance: 1 %; Technology: SMT
U4 = CMP-0321-00237-1: USB-Friendly Li-Ion Battery Charger and Power-Path Management IC, Vout 5.5 V, 4.3 V, -40 to 85 degC, 16-pin QFN (RGT), Green (RoHS & no Sb/Br); Manufacturer: Texas Instruments; Li-Ion: N; SubFamily: Battery Charge Management; Vin(Min)(V): 4.3; ComponentLink1URL: http://www.ti.com/general/docs/lit/getliterature.tsp?genericPartNumber=BQ24075&fileType=pdf; Over Voltage Protection: N; PackageDescription: 16-Pin Plastic Quad Flat No-Lead, 3 x 3 mm Body, 0.5 mm Pitch, 1.7 x 1.7 mm Exposed Pad; NiMH: N; Li-Polymer: N; Eco-Plan: Green (RoHS & no Sb/Br); Code_JEDEC: MO-220; Lead Acid: N; PartNumber: BQ24075RGTRG4; ComponentLink1Description: Datasheet; Mounting Technology: Surface Mount; PackageVersion: revH, Oct-2011; PackageReference: RGT16-1700X1700TP; NiCd: N; DatasheetVersion: SLUS810G

## Sheet BuckConverter.SchDoc: Buck Converter
size 431 x 279 mm; Revision: 1.0; SheetNumber: 1; SheetTotal: 1
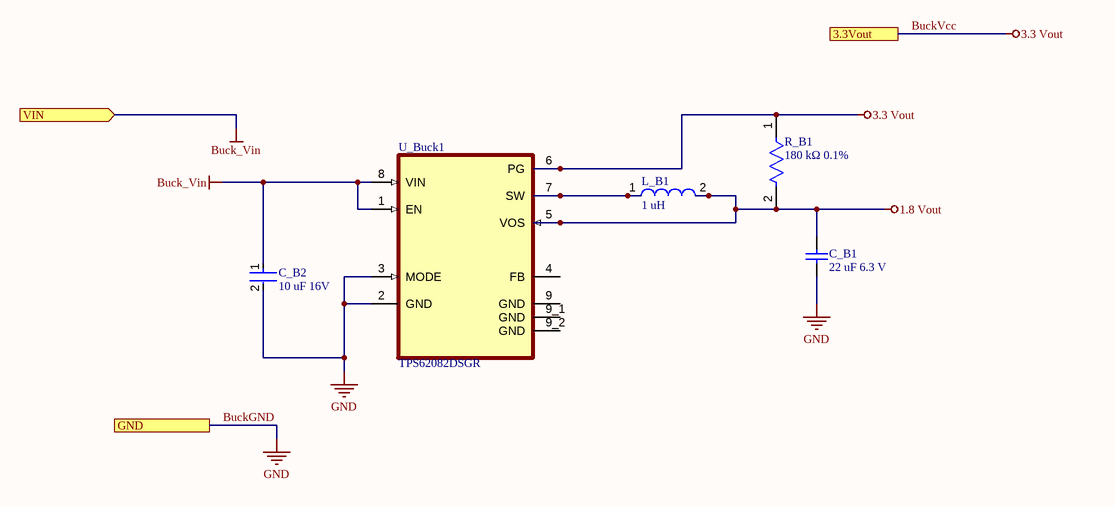
[diagram p4: BuckConverter.SchDoc]

### Parts
C_B1  22 uF 6.3 V  [CAPC1608X100X20ML10]
C_B2  10 uF 16V  [FP-C1608-MFG]
L_B1  1 uH  [WE-HCI-7040]
R_B1  180 kΩ 0.1%  [FP-CPF0603-MFG]
U_Buck1  TPS62082DSGR  [SON50P200X200X80-9N]

### Ports
3.3Vout, GND, VIN (in)

### Nets
1.8 Vout: C_B1.2 L_B1.2 R_B1.2 U_Buck1.5(VOS)
3.3 Vout: R_B1.1 U_Buck1.6(PG) ; port 3.3Vout  [also labelled BuckVcc]  [project net 3V3]
Buck_Vin: C_B2.1 U_Buck1.1(EN) U_Buck1.8(VIN) ; port VIN
GND: C_B1.1 C_B2.2 U_Buck1.2(GND) U_Buck1.3(MODE) ; port GND  [also labelled BuckGND]
NetL_B1_1: L_B1.1 U_Buck1.7(SW)

Not connected (* = marked no-connect by the designer): U_Buck1 4(FB) 9(GND) 9_1(GND) 9_2(GND)

### Notes on the sheet
- DWG. NO.
- REV.
- SHT.
- THIS DOCUMENT AND THE DATA DISCLOSED HEREIN OR HEREWITH IS THE PROPERTY OF ALTIUM LIMITED AND MAY BE FREELY DISTRIBUTED IN WHOLE. NO RIGHTS ARE RESERVED OR EXPRESS OR IMPLIED WARANTEE GIVEN.
- REVISION
- DESCRIPTION
- DATE
- APPROVED
- ENG:
- APPROVALS
- PROJECT
- DSN:
- CHK:
- REFERENCE DOCUMENTS
- PROJECT REVISION:
- TITLE
- DOCUMENT REVISION:
- DESIGN ITEM:
- BOM:
- FAB DWG:
- PCB DWG:
- ASSY DWG:
- SCALE:
- SIZE
- B
- CAGE CODE
- FILE NAME
- DWG NO.
- SHEET
- OF
- REV

### Library data of the parts
C_B1 = CMP-2000-05440-1: Chip Capacitor, 22 uF, +/- 20%, 6.3 V, -55 to 85 degC, 1608 (0603 Metric), RoHS, Tape and Reel; PCN Part Number: MLCCPartNumberChange30/Nov/2012; Manufacturer: TDK; Temperature Coefficient: X5R; Product Training Modules: CSeriesGeneralApplicationsSEAT,CCV,andTVCLDesignToolsGuidetoReplacinganElectrolyticCapacitorwithanMLCC; Other Names: 445-8028-1; Capacitance: 22µF; Voltage - Rated: 6.3V; Design Resources: 20WNon-IsolatedBuckLEDDriverUsingPLLNK460KG; Online Catalog: CSeries,GeneralPurpose; Kits: 445-9003-KIT-ND-KITCAPCERHICAPMLCCSMD; Tolerance: ±20%; Series: C; Thickness (Max): 0.039"(1.00mm); Mounting Type: SurfaceMount,MLCC; Ratings: -; Datasheet Version: Mar-15; Package Reference: 603; Packaging: CutTape(CT); Features: -; Package / Case: 0603(1608Metric); Family: CeramicCapacitors; Lead Spacing: -; RoHS Information: RoHSCertificate-MLCC; Manufacturer URL: http://www.tdk.com/; Lead Style: -; Category: Capacitors; Applications: GeneralPurpose; Package Description: 2-Pin Surface Mount Device, Body 1.6 x 0.8 mm; Standard Package: 1; Datasheet URL: http://www.farnell.com/datasheets/1913358.pdf; Height - Seated (Max): -; Operating Temperature: -55degC~85degC; Size / Dimension: 0.063"Lx0.031"W(1.60mmx0.80mm)
C_B2 = CMP-08246-000019-1: CAP CER 10UF 16V X5R 0603; Manufacturer: TDK Corporation; Manufacturer Part Number: C1608X5R1C106M080AB; Temperature Coefficient: 15%; Tolerance: 20%; Octopart: https://octopart.com/c1608x5r1c106m080ab-tdk-26013480; ComponentLink2Description: Datasheet; Value: 10uF; Temperature Range Low: -55°C; Digikey Description: CAP CER 10UF 16V X5R 0603; Package: C1608; Lead Free: Yes; Mouser Description: Multilayer Ceramic Capacitors MLCC - SMD/SMT 0603 10uF 16volts X5R +/-20% GP; Device Class L2: Capacitors; Voltage Rating: 16V; RoHS: TRUE; Automotive: No; Height: 0.9mm; Ipc Land Pattern Name: CAPC16080X80; ComponentLink2URL: https://upverter.com/datasheet/6fbac97fd59b4a24a005814037d2a36a27db40e9.pdf; Temperature Range High: +85°C; Capacitance: 10uF; Temperature: -55°C to +85°C; Category: Cap; Device Class L1: Passive Components; Device Class L3: Ceramic Capacitors; Temperature Characteristic: X5R; Material: Ceramic
L_B1 = CMP-0226-00067-1: 744311100 SMD Flat Wire High Current Inductor WE-HCI, L=1.00 µH; Inductance: 1.00 ÂµH; PackageReference: WE-HCI-7040; ComponentLink2Description: Datasheet; ComponentLink1Description: Manufacturer Link; PackageVersion: 2008; ComponentLink2URL: http://www.we-online.de/katalog/media/pdf/744311100.pdf; DatasheetVersion: ver 1, Feb-2008; PackageDescription: SMD Inductor, 2-Leads, Body 7.0 x 6.9 mm; ComponentLink1URL: http://www.we-online.com
R_B1 = CMP-03211-002805-1: RES SMD 180KΩ 0.1% 1/16W 0603; Manufacturer: TE Connectivity; Manufacturer Part Number: CPF0603B180KE; Power Rating: 0.063W; Temperature Coefficient: 25ppm/°C; Voltage Rating: 50V; Octopart: https://octopart.com/cpf0603b180ke-te+connectivity-23257790; Composition: Thin Film; Height: 0.55mm; Series: CPF; Tolerance: 0.1%; Value: 180KΩ; Device Class L3: Chip SMD Resistors; Automotive: No; Temperature Range High: +155°C; Temperature Range Low: -55°C; Package: CPF0603; RoHS: TRUE; Device Class L1: Passive Components; ComponentLink2URL: https://www.te.com/commerce/DocumentDelivery/DDEController?Action=showdoc&DocId=Data+Sheet%7F1773200%7FM%7Fpdf%7FEnglish%7FENG_DS_1773200_M.pdf%7F3-1676481-2; Category: Res; Lead Free: Yes; ComponentLink2Description: Datasheet; packaging: 5k Reel; octopart_url: https://octopart.com/cpf0603b180ke-te+connectivity-23257790; Ipc Land Pattern Name: RESC15580X45; Device Class L2: Resistors; Resistance: 180KΩ; Temperature: -55°C to +155°C
U_Buck1 = TPS62082DSGR: 1.2A High Efficient Step Down Converter in 2x2mm SON Package. 3.3 Vout (Min) 8-WSON -40 to 125; MF: Texas Instruments; SnapEDA_Link: https://www.snapeda.com/parts/TPS62082DSGR/Texas%20Instruments/view-part/232318/?ref=snap; Digi-Key_Part_Number: 296-49331-1-ND; Purchase-URL: https://pricing.snapeda.com/search/part/TPS62082DSGR/?ref=eda; Value: *; MP: TPS62082DSGR; Package: WSON-8 Texas Instruments; Check_prices: https://www.snapeda.com/parts/TPS62082DSGR/Texas%20Instruments/view-part/232318/?ref=eda

## Sheet Accelerometer.SchDoc
size 431 x 279 mm
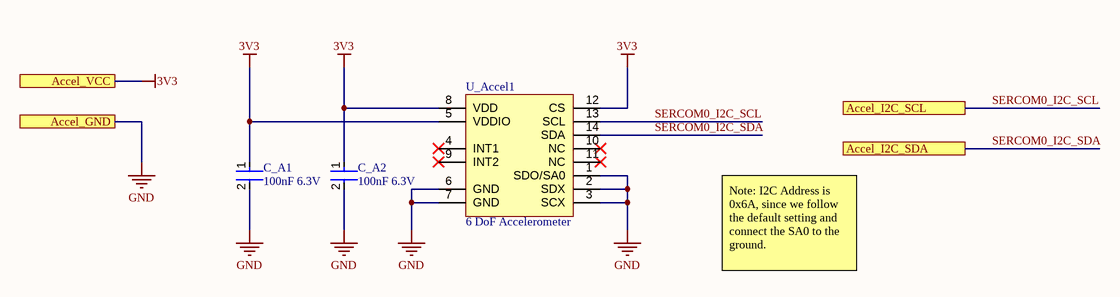
[diagram p5: Accelerometer.SchDoc]

### Parts
C_A1  100nF 6.3V  [FP-GRM033-0_03-IPC_A]
C_A2  100nF 6.3V  [FP-GRM033-0_03-IPC_A]
U_Accel1  6 DoF Accelerometer  [LSM6DSO]

### Ports
Accel_GND, Accel_I2C_SCL, Accel_I2C_SDA, Accel_VCC

### Nets
3V3: C_A1.1 C_A2.1 U_Accel1.5(VDDIO) U_Accel1.8(VDD) U_Accel1.12(CS) ; port Accel_VCC
GND: C_A1.2 C_A2.2 U_Accel1.1(SDO/SA0) U_Accel1.2(SDX) U_Accel1.3(SCX) U_Accel1.6(GND) U_Accel1.7(GND) ; port Accel_GND
SERCOM0_I2C_SCL: U_Accel1.13(SCL) ; port Accel_I2C_SCL
SERCOM0_I2C_SDA: U_Accel1.14(SDA) ; port Accel_I2C_SDA

Not connected (* = marked no-connect by the designer): U_Accel1 4(INT1)* 9(INT2)* 10(NC)* 11(NC)*

### Notes on the sheet
- Note: I2C Address is 0x6A, since we follow the default setting and connect the SA0 to the ground.
- DWG. NO.
- REV.
- SHT.
- THIS DOCUMENT AND THE DATA DISCLOSED HEREIN OR HEREWITH IS THE PROPERTY OF ALTIUM LIMITED AND MAY BE FREELY DISTRIBUTED IN WHOLE. NO RIGHTS ARE RESERVED OR EXPRESS OR IMPLIED WARANTEE GIVEN.
- REVISION
- DESCRIPTION
- DATE
- APPROVED
- ENG:
- APPROVALS
- PROJECT
- DSN:
- CHK:
- REFERENCE DOCUMENTS
- PROJECT REVISION:
- TITLE
- DOCUMENT REVISION:
- DESIGN ITEM:
- BOM:
- FAB DWG:
- PCB DWG:
- ASSY DWG:
- SCALE:
- SIZE
- B
- CAGE CODE
- FILE NAME
- DWG NO.
- SHEET
- OF
- REV

### Library data of the parts
C_A1 C_A2 = CMP-06035-061037-1: Chip Multilayer Ceramic Capacitors for General Purpose, 0201, 0.10uF, X6S, 22%, 20%, 6.3V; Case Code (Imperial): 0201; Min Operating Temperature: -55°C; Thickness: 0.013inch; Width: 0.012inch; Mount: Surface Mount; Height: 0.3mm; Case/Package: 0201; Tolerance: 20%; Weight: 1.2E-05oz; Packaging: Tape and Reel; Package Quantity: 15000; Capacitance: 100nF; Case Code (Metric): 0603; Voltage Rating (DC): 6.3V; Termination: SMD/SMT; Length: 0.024inch; Voltage Rating: 6.3V; Dielectric: X6S; Max Operating Temperature: 105°C
U_Accel1 = LSM6DSO32TR: Accelerometer and 3D Gyroscope 3D Always-On 1.71V to 3.6V 0.55mA 14-Pin LGA T/R; Manufacturer: STMicroelectronics; Supplier 1: Digi-Key; Supplier Part Number 1: 497-LSM6DSO32CT-ND; Manufacturer Part Number: LSM6DSO32TR; RoHS: Yes; Category: Inertial Measurement Units (IMUs); Stock 1: 3420; Pricing 1: 1=4.97000, 10=4.46700, 25=4.22280, 100=3.65990, 500=3.12812 (USD)

## Sheet MCU.SchDoc: MCU Module
size 431 x 279 mm; Revision: 1.0; SheetNumber: 1; SheetTotal: 1
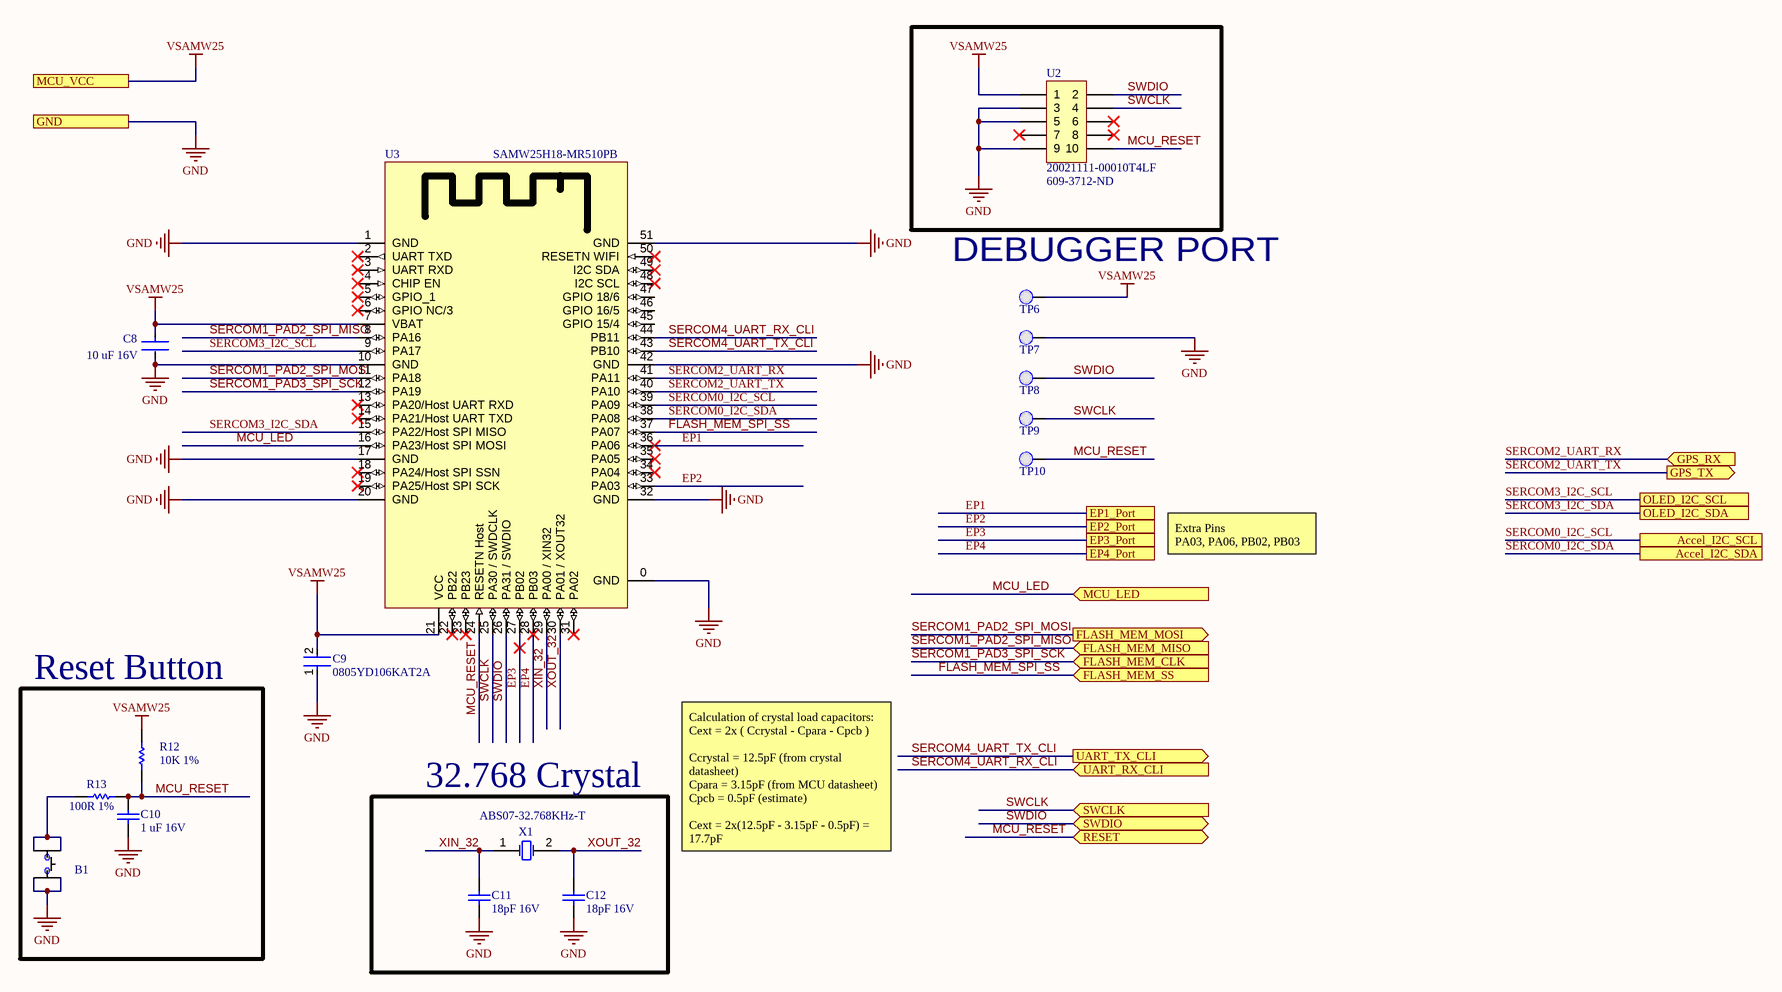
[diagram p6: MCU.SchDoc]

### Parts
B1  PTS810 SJK 250 SMTR LFS  [PTS810 SJK 250 SMTR LFS]  (value not drawn)
C8  10 uF 16V  [FP-0805-L_2_01_0_2-W_1_25-MFG]
C9  0805YD106KAT2A  [FP-0805-L_2_01_0_2-W_1_25-MFG]
C10  1 uF 16V  [CAPC1608X90X35ML15T15]
C11  18pF 16V  [CAPC0603(1608)100_N]
C12  18pF 16V  [CAPC0603(1608)100_N]
R12  10K 1%  [RESC1609X55X30LL15T15]
R13  100R 1%  [RESC0603(1608)_N]
TP6  0.1" Pad  [PCBComponent]  (value not drawn)
TP7  0.1" Pad  [PCBComponent]  (value not drawn)
TP8  0.1" Pad  [PCBComponent]  (value not drawn)
TP9  0.1" Pad  [PCBComponent]  (value not drawn)
TP10  0.1" Pad  [PCBComponent]  (value not drawn)
U2  20021111-00010T4LF  Supplier Part Number 1: 609-3712-ND  [20021111-00010T4LF]
U3  SAMW25H18-MR510PB  [SAMW25H18-MR510PB]
X1  ABS07-32.768KHz-T  [ABRA-ABS07-2_V]

### Blocks framed on the sheet
Reset Button: B1 C10 R12 R13
32.768 Crystal: C11 C12 X1

### Ports
Accel_I2C_SCL, Accel_I2C_SDA, EP1_Port, EP2_Port, EP3_Port, EP4_Port, FLASH_MEM_CLK (in), FLASH_MEM_MISO (in), FLASH_MEM_MOSI (out), FLASH_MEM_SS (in), GND, GPS_RX (in), GPS_TX (out), MCU_LED (in), MCU_VCC, OLED_I2C_SCL, OLED_I2C_SDA, RESET (bidir), SWCLK (in), SWDIO (bidir), UART_RX_CLI (in), UART_TX_CLI (out)

### Nets
GND: B1.3 B1.4 C8.2 C9.1 C10.1 C11.1 C12.1 TP7.1(PAD) U2.3 U2.5 U2.9 U3.0(GND) U3.1(GND) U3.10(GND) U3.17(GND) U3.20(GND) U3.32(GND) U3.42(GND) U3.51(GND) ; port GND
VSAMW25: C8.1 C9.2 R12.2 TP6.1(PAD) U2.1 U3.7(VBAT) U3.21(VCC) ; port MCU_VCC  [project net 3V3]
EP1: U3.36(PA06) ; port EP1_Port
EP2: U3.33(PA03) ; port EP2_Port
EP3: U3.27(PB02) ; port EP3_Port
EP4: U3.28(PB03) ; port EP4_Port
FLASH_MEM_SPI_SS: U3.37(PA07) ; port FLASH_MEM_SS
MCU_LED: U3.16(PA23/Host_SPI_MOSI) ; port MCU_LED
MCU_RESET: C10.2 R12.1 R13.2 TP10.1(PAD) U2.10 U3.24(RESETN_Host) ; port RESET
SERCOM0_I2C_SCL: U3.39(PA09) ; port Accel_I2C_SCL
SERCOM0_I2C_SDA: U3.38(PA08) ; port Accel_I2C_SDA
SERCOM1_PAD2_SPI_MISO: U3.8(PA16) ; port FLASH_MEM_MISO
SERCOM1_PAD2_SPI_MOSI: U3.11(PA18) ; port FLASH_MEM_MOSI
SERCOM1_PAD3_SPI_SCK: U3.12(PA19) ; port FLASH_MEM_CLK
SERCOM2_UART_RX: U3.41(PA11) ; port GPS_RX
SERCOM2_UART_TX: U3.40(PA10) ; port GPS_TX
SERCOM3_I2C_SCL: U3.9(PA17) ; port OLED_I2C_SCL
SERCOM3_I2C_SDA: U3.15(PA22/Host_SPI_MISO) ; port OLED_I2C_SDA
SERCOM4_UART_RX_CLI: U3.44(PB11) ; port UART_RX_CLI  [project net MCU_RX_UART_CLI]
SERCOM4_UART_TX_CLI: U3.43(PB10) ; port UART_TX_CLI  [project net MCU_TX_UART_CLI]
SWCLK: TP9.1(PAD) U2.4 U3.25(PA30_/_SWDCLK) ; port SWCLK
SWDIO: TP8.1(PAD) U2.2 U3.26(PA31_/_SWDIO) ; port SWDIO
XIN_32: C11.2 U3.29(PA00_/_XIN32) X1.1(X1)  [project net XIN_32_1]
XOUT_32: C12.2 U3.30(PA01_/_XOUT32) X1.2(X2)  [project net XOUT_32_1]
NetB1_1: B1.1 B1.2 R13.1

Not connected (* = marked no-connect by the designer): U2 6* 7* 8*; U3 2(UART_TXD)* 3(UART_RXD)* 4(CHIP_EN)* 5(GPIO_1)* 6(GPIO_NC/3)* 13(PA20/Host_UART_RXD)* 14(PA21/Host_UART_TXD)* 18(PA24/Host_SPI_SSN)* 19(PA25/Host_SPI_SCK)* 22(PB22)* 23(PB23)* 31(PA02)* 34(PA04)* 35(PA05)* 45(GPIO_15/4) 46(GPIO_16/5) 47(GPIO_18/6) 48(I2C_SCL)* 49(I2C_SDA)* 50(RESETN_WIFI)*

### Notes on the sheet
- (near TP6) DEBUGGER PORT
- Extra Pins
  PA03, PA06, PB02, PB03
- Calculation of crystal load capacitors:
  Cext = 2x ( Ccrystal - Cpara - Cpcb )
  Ccrystal = 12.5pF (from crystal datasheet)
  Cpara = 3.15pF (from MCU datasheet)
  Cpcb = 0.5pF (estimate)
  Cext = 2x(12.5pF - 3.15pF - 0.5pF) = 17.7pF
- DWG. NO.
- REV.
- SHT.
- THIS DOCUMENT AND THE DATA DISCLOSED HEREIN OR HEREWITH IS THE PROPERTY OF ALTIUM LIMITED AND MAY BE FREELY DISTRIBUTED IN WHOLE. NO RIGHTS ARE RESERVED OR EXPRESS OR IMPLIED WARANTEE GIVEN.
- REVISION
- DESCRIPTION
- DATE
- APPROVED
- ENG:
- APPROVALS
- PROJECT
- DSN:
- CHK:
- REFERENCE DOCUMENTS
- PROJECT REVISION:
- TITLE
- DOCUMENT REVISION:
- DESIGN ITEM:
- BOM:
- FAB DWG:
- PCB DWG:
- ASSY DWG:
- SCALE:
- SIZE
- B
- CAGE CODE
- FILE NAME
- DWG NO.
- SHEET
- OF
- REV

### Library data of the parts
B1 = PTS810 SJK 250 SMTR LFS: SWITCH TACTILE SPST-NO 0.05A 16V Tactile Switch SPST-NO Top Actuated Surface Mount; Manufacturer: ITT /  C&K Components; Part # Aliases: Y97LT25B5DBFP; Operating Force: 2.6 N; Actuator: Oval; Current Rating: 50 mA; Voltage Rating DC: 16 VDC; Contact Form: SPST; Switch Function: OFF - (ON); Mounting Direction: Straight; Stem Height: 2.5 mm; Brand: C&K Components; Travel: 0.15 mm; Manufacturer Part Number: PTS810SJK250SMTRLFS; Product Category: Tactile Switches; RoHS: Details; Termination Style: J Form Lead; Mounting Style: SMD/SMT; Color: White; Packaging: Reel; Contact Plating: Silver; Operating Temperature Range: - 40 C to + 85 C; Series: PTS810; Factory Pack Quantity: 2900; ComponentLink1URL: https://datasheet.ciiva.com/18514/pts810-4mar13-18514061.pdf; ComponentLink1Description: https://datasheet.ciiva.com/18514/pts810-4mar13-18514061.pdf; ComponentLink2URL: https://datasheet.ciiva.com/18514/pts810-4mar13-18514062.pdf; ComponentLink2Description: https://datasheet.ciiva.com/18514/pts810-4mar13-18514062.pdf; ComponentLink3URL: https://datasheet.ciiva.com/18514/pts810-4mar13-18514063.pdf; ComponentLink3Description: https://datasheet.ciiva.com/18514/pts810-4mar13-18514063.pdf; Supplier 1: Digi-Key; Supplier Part Number 1: CKN10503CT-ND
C8 C9 = CMP-1036-04927-3: General Purpose Ceramic Capacitor, 0805, 10uF, 10%, X5R, 15%, 16V; Tolerance: 10%; Capacitance: 10uF; Case/Package: 0805; Case Code (Imperial): 0805; Case Code (Metric): 2012; Construction: Flat; Contact Plating: Tin; Depth: 1.25mm; Dielectric: X5R; Dielectric Material: Ceramic; Height: 1.4mm; Lead Free: Lead Free; Length: 2.01mm; Max Operating Temperature: 85°C; Min Operating Temperature: -55°C; Mount: Surface Mount; Number of Pins: 2; Package Quantity: 1; Packaging: Tape and Reel; Radiation Hardening: No; REACH SVHC: No SVHC; RoHS Compliant: Yes; Series: -; Termination: SMD/SMT; Thickness: 0.055inch; Voltage: 16V; Voltage Rating (DC): 16V; Voltage Rating: 16V; Width: 0.049inch
C10 = CMP-1035-02736-2: as C14 on sheet LiPo_Charger; Part Number: 0603YC105JAT2A
C11 C12 = CMP-1035-00738-1: CAP 18pF 16V ±5% 0603 (1608 Metric) Thickness 1mm SMD; Tolerance: Â±5%; Case-EIA: 0603; Case-Metric: 1608; Max Thickness: 1 mm; Rated Voltage: 16 V; Value: 18pF; Technology: SMT
R12 = CMP-1012-00623-3: as R14 on sheet Memory; Tolerance: 1%; Case Code (Imperial): 0603; Case Code (Metric): 1608; Composition: ThickFilm; Contact Plating: Tin; Datasheet URL: https://industrial.panasonic.com/cdbs/www-data/pdf/RDA0000/AOA0000C304.pdf; Datasheet Version: 02/2017; Depth: 0.8mm; Height: 0.45mm; Lead Free: LeadFree; Length: 1.6mm; Manufacturer URL: http://www.panasonic.com/; Max Operating Temperature: 155degC; Military Standard: Not; Min Operating Temperature: -55degC; Mount: SurfaceMount; Mounting Technology: SurfaceMount; Number of Pins: 2; Number of Terminations: 2; Package Description: 2-Pin Surface Mount Device, Body 1.6 x 0.85 mm; Package Quantity: 1; Package Reference: 603; Packaging: TapeandReel; Power Rating: 100mW; Radiation Hardening: No; REACH SVHC: NoSVHC; RoHSCompliant: true; Termination: SMD/SMT; Voltage Rating: 75V; Width: 0.031inch
R13 = CMP-1012-00397-1: 100R 0.1W 1% 0603 (1608 Metric)  SMD; Value: 100.00 Ohm; Case-EIA: 0603; Case-Metric: 1608; Technology: SMT; Tolerance: 1 %; Power: 0.1 W
TP6-TP10 = 0.1" Pad-A.4
U2 = 20021111-00010T4LF: CONN HEADER 10POS UNSHD VERT T/H; Manufacturer: Amphenol / FCI; Stack Height: 2.5 mm; Number of Positions / Contacts: 10; Brand: FCI; Pitch: 1.27 mm; Mounting Angle: Vertical; Current Rating: 10 A; Mating Post Length: 3.05 mm; Voltage Rating: 125 V; Manufacturer Part Number: 20021111-00010T4LF; Mounting Style: Through Hole; Product Category: Headers & Wire Housings; RoHS: Details; Series: Minitek; Product Type: Headers; Type: Unshrouded; Number of Positions: 10; Number of Rows: 2; Contact Plating: Gold; Housing Material: Plastic; Termination Style: Through Hole; Contact Material: Nickel; Packaging: Tube; Factory Pack Quantity: 93; Termination Post Length: 2.3 mm; ComponentLink1URL: https://datasheet.ciiva.com/1433/1079612-1433267.pdf; ComponentLink1Description: https://datasheet.ciiva.com/1433/1079612-1433267.pdf; ComponentLink2URL: https://datasheet.ciiva.com/409/20021111-409158.pdf; ComponentLink2Description: https://datasheet.ciiva.com/409/20021111-409158.pdf; ComponentLink3URL: https://datasheet.ciiva.com/5131/20021111-5131386.pdf; ComponentLink3Description: https://datasheet.ciiva.com/5131/20021111-5131386.pdf; ComponentLink4URL: https://datasheet.ciiva.com/9465/20021111-9465402.pdf; ComponentLink4Description: https://datasheet.ciiva.com/9465/20021111-9465402.pdf; Supplier 1: Digi-Key
U3 = SAMW25H18-MR510PB: RF TXRX MODULE WIFI TRACE ANT; Manufacturer: Atmel; Manufacturer Part Number: ATSAMW25H18-MR510PB; Protocol: 802.11b/g/n; Frequency: 2.4GHz; Data Rate: 65Mbps; Power - Output: 17dBm; Sensitivity: -95.5dBm; Serial Interfaces: SPI, UART; Antenna Type: Integrated, Trace; Memory Size: 256kB Flash, 32kB SRAM; Voltage - Supply: 2.7 V ~ 4.2 V; Category: RF/IF and RFID; Family: RF Transceiver Modules; Series: Xplained Pro; Packaging: Tray; RF Family/Standard: WiFi; Modulation: -; Current - Receiving: -; Current - Transmitting: -; Mounting Type: Surface Mount; Operating Temperature: -40°C ~ 85°C; Package / Case: Module; ComponentLink1URL: http://www.atmel.com/devices/ATSAMW25.aspx; ComponentLink1Description: http://www.atmel.com/devices/ATSAMW25.aspx; ComponentLink2URL: http://www.farnell.com/datasheets/1965115.pdf; ComponentLink2Description: http://www.farnell.com/datasheets/1965115.pdf; Supplier 1: Digikey; Stock 1: 120; Pricing 1: 1=19.14 (USD); Supplier Part Number 1: ATSAMW25H18-MR510PB-ND
X1 = CMP-0447-00001-2: Crystal, 32.768 kHz, 12.5 pF, -40 to 85 degC, SMD Low Profile 3.2 x 1.5 x 0.9 mm, Tape and Reel; Manufacturer: Abracon; Q Value (Type): 30000; Operation Mode: Flexural Mode (Tuning Fork); Shunt Capacitance (C0): 0.9 to 1.2 pF; Load Capacitance (CL): 12.5 pF; Frequency Tolerance @+25degC: +/- 20 ppm; Drive Level (Type): 0.1 uW; Equivalent Series Resistance (R1): 70 Kohm; Insulation Resistance (Min): 500 Mohm; ComponentLink3URL: http://www.abracon.com/Resonators/ABS07.pdf; PackageDescription: 2-Pin Hand Drawn, Body 3.2x1.5mm, Pitch 2.5mm; Operating Temperature: -40 to 85 degC; ComponentLink2URL: http://www.abracon.com/Resonators/ABS07.pdf; PackageReference: ABS07-2; ComponentLink3Description: Package Specification; ComponentLink1Description: Manufacturer URL; DatasheetVersion: 04.03.13; Mounting Technology: Surface Mount; ComponentLink2Description: Datasheet; ComponentLink1URL: http://www.abracon.com/; PartNumber: ABS07-32.768KHz-T; Packing: Tape and Reel; Frequency: 32.768 kHz

## Nets that join several sheets
3V3: MAIN (9 pins), Memory (5 pins), BuckConverter (R_B1.1 U_Buck1.6), Accelerometer (5 pins), MCU (7 pins)
Buck_Vin: MAIN (RJ1.2), BuckConverter (C_B2.1 U_Buck1.1 U_Buck1.8)
GND: MAIN (14 pins), FTDI (10 pins), Memory (5 pins), LiPo_Charger (11 pins), BuckConverter (C_B1.1 C_B2.2 U_Buck1.2 U_Buck1.3), Accelerometer (7 pins), MCU (19 pins)
VBAT: MAIN (P1.3), LiPo_Charger (C16.1 U4.2 U4.3)
VBUS: MAIN (J1.1), FTDI (C2.2 D2.4 FB1.1)
Vout_BQ: MAIN (R6.1), LiPo_Charger (6 pins)
VUSB: MAIN (TP1.1), FTDI (6 pins), LiPo_Charger (C14.2 U4.13)
BQ_BAT_TS: MAIN (R7.1 TP5.1), LiPo_Charger (U4.1)
EP1: MAIN (P4.1), MCU (U3.36)
EP2: MAIN (P4.2), MCU (U3.33)
EP3: MAIN (P4.3), MCU (U3.27)
EP4: MAIN (P4.4), MCU (U3.28)
FLASH_MEM_SPI_SS: Memory (R14.1 SD1.2 TP16.1), MCU (U3.37)
MCU_LED: MAIN (DS1.1), MCU (U3.16)
MCU_RX_UART_CLI: MAIN (TP4.1), FTDI (U1.7), MCU (U3.44)
MCU_TX_UART_CLI: MAIN (TP2.1), FTDI (U1.10), MCU (U3.43)
MEM_SPI_CLK: MAIN (R10.2), Memory (SD1.5 TP15.1)
MEM_SPI_MISO: MAIN (R9.2), Memory (SD1.7 TP14.1)
MEM_SPI_MOSI: MAIN (R8.2), Memory (SD1.3 TP13.1)
SERCOM0_I2C_SCL: MAIN (P2.1 R_A1.2 TP_ACC_1.1), Accelerometer (U_Accel1.13), MCU (U3.39)
SERCOM0_I2C_SDA: MAIN (P2.2 R_A2.2 TP_ACC_2.1), Accelerometer (U_Accel1.14), MCU (U3.38)
SERCOM1_PAD2_SPI_MISO: MAIN (R9.1), MCU (U3.8)
SERCOM1_PAD2_SPI_MOSI: MAIN (R8.1), MCU (U3.11)
SERCOM1_PAD3_SPI_SCK: MAIN (R10.1), MCU (U3.12)
SERCOM2_UART_RX: MAIN (P3.1 TP_GPS_2.1), MCU (U3.41)
SERCOM2_UART_TX: MAIN (P3.2 TP_GPS_1.1), MCU (U3.40)
SERCOM3_I2C_SCL: MAIN (P5.1 R_O1.2 TP_OLED_1.1), MCU (U3.9)
SERCOM3_I2C_SDA: MAIN (P5.2 R_O2.2 TP_OLED_2.1), MCU (U3.15)
USB_DATA_N: MAIN (J1.2), FTDI (C5.2 D2.3 R1.1)
USB_DATA_P: MAIN (J1.3), FTDI (C6.2 D2.2 R2.1)

## Assembly variants
Build_Alt: not fitted FD1 FD2 FD3 TP1 TP2 TP3 TP4 TP5 TP6 TP6 TP7 TP7 TP8 TP8 TP9 TP9 TP10 TP10 TP11 TP_ACC_1 TP_ACC_2 TP_BUCK_1 TP_BUCK_2 TP_GPS_1 TP_GPS_2 TP_OLED_1 TP_OLED_2